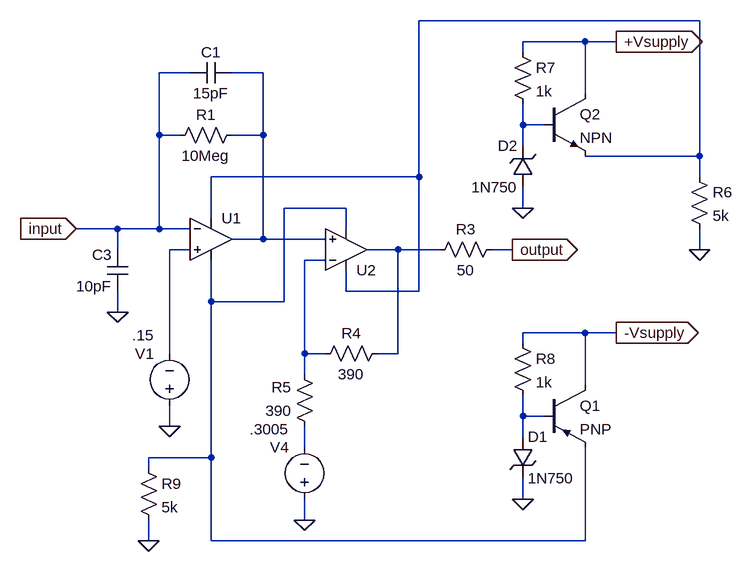
[diagram p0: schematic CR-111-R2.1.asc]
CR-111-R2.1.asc, the LTspice schematic file:
Version 4
SHEET 1 1264 680
WIRE 832 -304 400 -304
WIRE 656 -272 560 -272
WIRE 704 -272 656 -272
WIRE 560 -256 560 -272
WIRE 48 -224 0 -224
WIRE 160 -224 112 -224
WIRE 656 -192 656 -272
WIRE 560 -144 560 -176
WIRE 592 -144 560 -144
WIRE 0 -128 0 -224
WIRE 32 -128 0 -128
WIRE 160 -128 160 -224
WIRE 160 -128 112 -128
WIRE 560 -112 560 -144
WIRE 832 -96 832 -304
WIRE 832 -96 656 -96
WIRE 400 -64 400 -304
WIRE 400 -64 80 -64
WIRE 832 -64 832 -96
WIRE 288 -16 192 -16
WIRE 560 -16 560 -48
WIRE 80 0 80 -64
WIRE -64 16 -128 16
WIRE 0 16 0 -128
WIRE 0 16 -64 16
WIRE 48 16 0 16
WIRE 288 16 288 -16
WIRE 160 32 160 -128
WIRE 160 32 112 32
WIRE 256 32 160 32
WIRE -64 48 -64 16
WIRE 48 48 16 48
WIRE 368 48 320 48
WIRE 432 48 368 48
WIRE 544 48 512 48
WIRE 832 48 832 16
WIRE 256 64 224 64
WIRE 288 112 288 80
WIRE 400 112 400 -64
WIRE 400 112 288 112
WIRE 80 128 80 64
WIRE 192 128 192 -16
WIRE 192 128 80 128
WIRE -64 144 -64 112
WIRE 656 176 560 176
WIRE 704 176 656 176
WIRE 560 192 560 176
WIRE 16 208 16 48
WIRE 224 208 224 64
WIRE 256 208 224 208
WIRE 368 208 368 48
WIRE 368 208 336 208
WIRE 224 240 224 208
WIRE 656 256 656 176
WIRE 560 304 560 272
WIRE 592 304 560 304
WIRE 16 320 16 288
WIRE 560 336 560 304
WIRE 224 352 224 320
WIRE 80 368 80 128
WIRE 80 368 -16 368
WIRE -16 384 -16 368
WIRE 560 432 560 400
WIRE 224 464 224 432
WIRE -16 496 -16 464
WIRE 80 496 80 368
WIRE 656 496 656 352
WIRE 656 496 80 496
FLAG -128 16 input
IOPIN -128 16 In
FLAG 544 48 output
IOPIN 544 48 Out
FLAG 16 320 0
FLAG -64 144 0
FLAG 224 464 0
FLAG 704 176 -Vsupply
IOPIN 704 176 Out
FLAG 704 -272 +Vsupply
IOPIN 704 -272 Out
FLAG -16 496 0
FLAG 832 48 0
FLAG 560 -16 0
FLAG 560 432 0
SYMBOL res 128 -144 R90
WINDOW 0 0 56 VBottom 2
WINDOW 3 32 56 VTop 2
SYMATTR InstName R1
SYMATTR Value 10Meg
SYMBOL cap 112 -240 R90
WINDOW 0 0 32 VBottom 2
WINDOW 3 32 32 VTop 2
SYMATTR InstName C1
SYMATTR Value 15pF
SYMBOL cap -48 112 R180
WINDOW 0 24 56 Left 2
WINDOW 3 24 8 Left 2
SYMATTR InstName C3
SYMATTR Value 10pF
SYMBOL res 528 32 R90
WINDOW 0 0 56 VBottom 2
WINDOW 3 32 56 VTop 2
SYMATTR InstName R3
SYMATTR Value 50
SYMBOL res 352 192 R90
WINDOW 0 0 56 VBottom 2
WINDOW 3 32 56 VTop 2
SYMATTR InstName R4
SYMATTR Value 390
SYMBOL res 240 336 R180
WINDOW 0 36 76 Left 2
WINDOW 3 36 40 Left 2
SYMATTR InstName R5
SYMATTR Value 390
SYMBOL voltage 16 304 R180
WINDOW 0 24 96 Left 2
WINDOW 3 24 124 Left 2
WINDOW 123 0 0 Left 2
WINDOW 39 0 0 Left 2
SYMATTR InstName V1
SYMATTR Value .15
SYMBOL voltage 224 448 R180
WINDOW 0 24 96 Left 2
WINDOW 3 24 124 Left 2
WINDOW 123 0 0 Left 2
WINDOW 39 0 0 Left 2
SYMATTR InstName V4
SYMATTR Value .3005
SYMBOL pnp 592 256 R0
SYMATTR InstName Q1
SYMBOL npn 592 -192 R0
SYMATTR InstName Q2
SYMBOL res 816 -80 R0
SYMATTR InstName R6
SYMATTR Value 5k
SYMBOL res -32 368 R0
SYMATTR InstName R9
SYMATTR Value 5k
SYMBOL res 544 -272 R0
SYMATTR InstName R7
SYMATTR Value 1k
SYMBOL res 544 176 R0
SYMATTR InstName R8
SYMATTR Value 1k
SYMBOL zener 544 336 R0
SYMATTR InstName D1
SYMATTR Value 1N750
SYMBOL zener 576 -48 R180
WINDOW 0 24 64 Left 2
WINDOW 3 24 0 Left 2
SYMATTR InstName D2
SYMATTR Value 1N750
SYMBOL Opamps\\UniversalOpamp2 288 48 M180
SYMATTR InstName U2
SYMATTR Value2 Avol=1Meg GBW=500Meg Slew=500Meg
SYMATTR SpiceLine2 en=0 enk=0 in=0 ink=0 Rin=5000Meg
SYMBOL Opamps\\UniversalOpamp2 80 32 R0
SYMATTR InstName U1
SYMATTR Value2 Avol=3000 GBW=450Meg Slew=500Meg
SYMATTR SpiceLine2 en=0 enk=0 in=0 ink=0 Rin=5000Meg

The netlist it stands for:
* CR-111-R2.1.asc
R1 N002 input 10Meg
C1 N002 input 15pF
C3 0 input 10pF
R3 output N006 50
R4 N006 N007 390
R5 N009 N007 390
V1 0 N005 .15
V4 0 N009 .3005
Q1 -Vsupply N008 N004 0 PNP
Q2 +Vsupply N003 N001 0 NPN
R6 N001 0 5k
R9 N004 0 5k
R7 +Vsupply N003 1k
R8 -Vsupply N008 1k
D1 N008 0 1N750
D2 0 N003 1N750
XU2 N002 N007 N001 N004 N006 level.2 Avol=1Meg GBW=500Meg Slew=500Meg ilimit=25m rail=0 Vos=0 phimargin=45 en=0 enk=0 in=0 ink=0 Rin=5000Meg  ; pins IN+ IN- V+ V- OUT
XU1 N005 input N001 N004 N002 level.2 Avol=3000 GBW=450Meg Slew=500Meg ilimit=25m rail=0 Vos=0 phimargin=45 en=0 enk=0 in=0 ink=0 Rin=5000Meg  ; pins IN+ IN- V+ V- OUT
.model D D
.lib standard.dio
.model NPN NPN
.model PNP PNP
.lib standard.bjt
.lib UniversalOpamps2.sub
.backanno
.end